# EAGLE design lilla.pa1 (EAGLE 4.11)
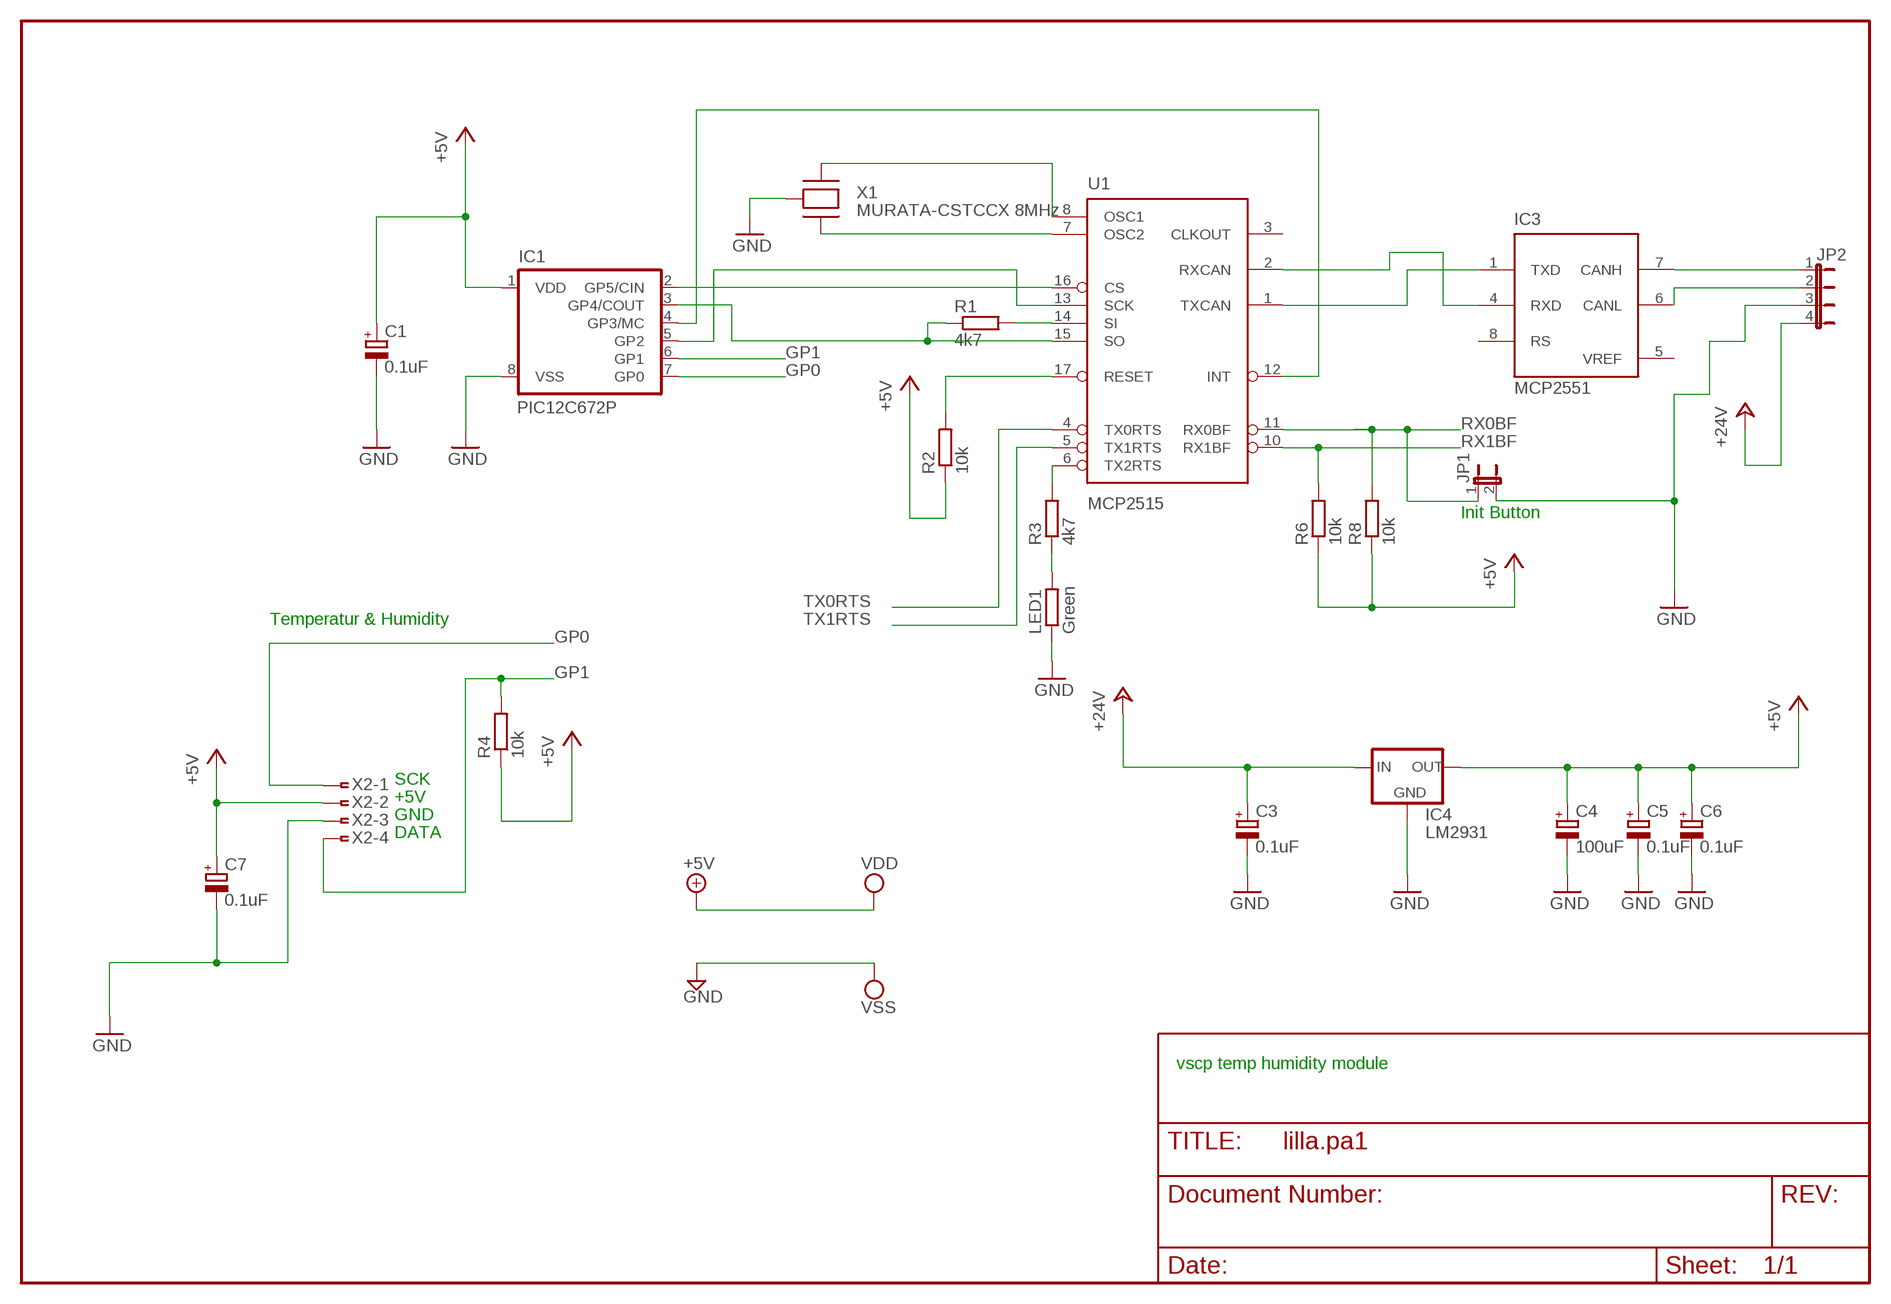
[diagram p0: schematic, sheet 1]

## Parts
C1  0.1uF  CPOL-EUCT3216  [CT3216]
C3  0.1uF  CPOL-EUCT3216  [CT3216]
C4  100uF  CPOL-EUCT7343  [CT7343]
C5  0.1uF  CPOL-EUCT3216  [CT3216]
C6  0.1uF  CPOL-EUCT3216  [CT3216]
C7  0.1uF  CPOL-EUCT3216  [CT3216]
IC1  PIC12C672P  [DIL8]
IC3  MCP2551  MCP2551SN  [SO-08]
IC4  LM2931  78LXX  [78LXX]
JP1  JP1E  [JP1]
JP2  JP4E  [JP4]
LED1  Green  R-EU_R1206  [R1206]
R1  4k7  R-EU_R0805  [R0805]
R2  10k  R-EU_R0805  [R0805]
R3  4k7  R-EU_R0805  [R0805]
R4  10k  R-EU_R0805  [R0805]
R6  10k  R-EU_R0805  [R0805]
R8  10k  R-EU_R0805  [R0805]
U1  MCP2515  MCP2510SO  [SO-18W]
X1  MURATA-CSTCCX 8MHz  MURATA-CSTCCX  [RESONATOR-MURATA-CSTCCX]
X2  FTOP-4  [FTOP-4]

## Nets
+5V: C1.+ C4.+ C5.+ C6.+ C7.+ IC1.1(VDD) IC4.OUT R2.1 R4.1 R6.1 R8.1 X2.2
+24V: C3.+ IC4.IN JP2.4
CANH: IC3.7(CANH) JP2.1
CANL: IC3.6(CANL) JP2.2
GND: C1.- C3.- C4.- C5.- C6.- C7.- IC1.8(VSS) IC4.GND JP1.2 JP2.3 LED1.1 X1.2(GND) X2.3
GP0: IC1.7(GP0) X2.1
GP1: IC1.6(GP1) R4.2 X2.4
GP2: IC1.5(GP2) U1.13(SCK)
GP3: IC1.4(GP3/MC) U1.12(INT)
GP4: IC1.3(GP4/COUT) R1.1 U1.15(SO)
GP5: IC1.2(GP5/CIN) U1.16(CS)
N$3: R2.2 U1.17(RESET)
N$7: R1.2 U1.14(SI)
N$10: LED1.2 R3.1
OSC1: U1.8(OSC1) X1.3(XTIN)
OSC2: U1.7(OSC2) X1.1(XTOUT)
RX0BF: JP1.1 R8.2 U1.11(RX0BF)
RX1BF: R6.2 U1.10(RX1BF)
RXCAN: IC3.4(RXD) U1.2(RXCAN)
TX0RTS: U1.4(TX0RTS)
TX1RTS: U1.5(TX1RTS)
TX2RTS: R3.2 U1.6(TX2RTS)
TXCAN: IC3.1(TXD) U1.1(TXCAN)
Unconnected: IC3.8(RS) U1.3(CLKOUT)

## Notes on the sheet
- Init Button
- Temperatur & Humidity
- SCK
- +5V
- GND
- DATA
- vscp temp humidity module

## Power pins joined to a net without a drawn wire
VDD: IC3.3(VDD) U1.18(VDD)
VREF: IC3.5(VREF)
VSS: IC3.2(VSS) U1.9(VSS)

## Library data of the parts
C1 C3-C7 = rcl:CPOL-EU: POLARIZED CAPACITOR, European symbol
IC1 = microchip:PIC12C*?: MICROCONTROLLER
IC3 = microchip_can:MCP2551: High Speed CAN tranceiver
IC4 = v-reg:78LXX: VOLTAGE REGULATOR
JP1 = jumper:JP1E: JUMPER
JP2 = jumper:JP4E: JUMPER
LED1 R1-R4 R6 R8 = rcl:R-EU_: RESISTOR, European symbol
U1 = microchip_can:MCP2510
X1 = eurosource_ftdi:MURATA-CSTCCX
X2 = con-amp:FTOP-4: AMP connector

## Board
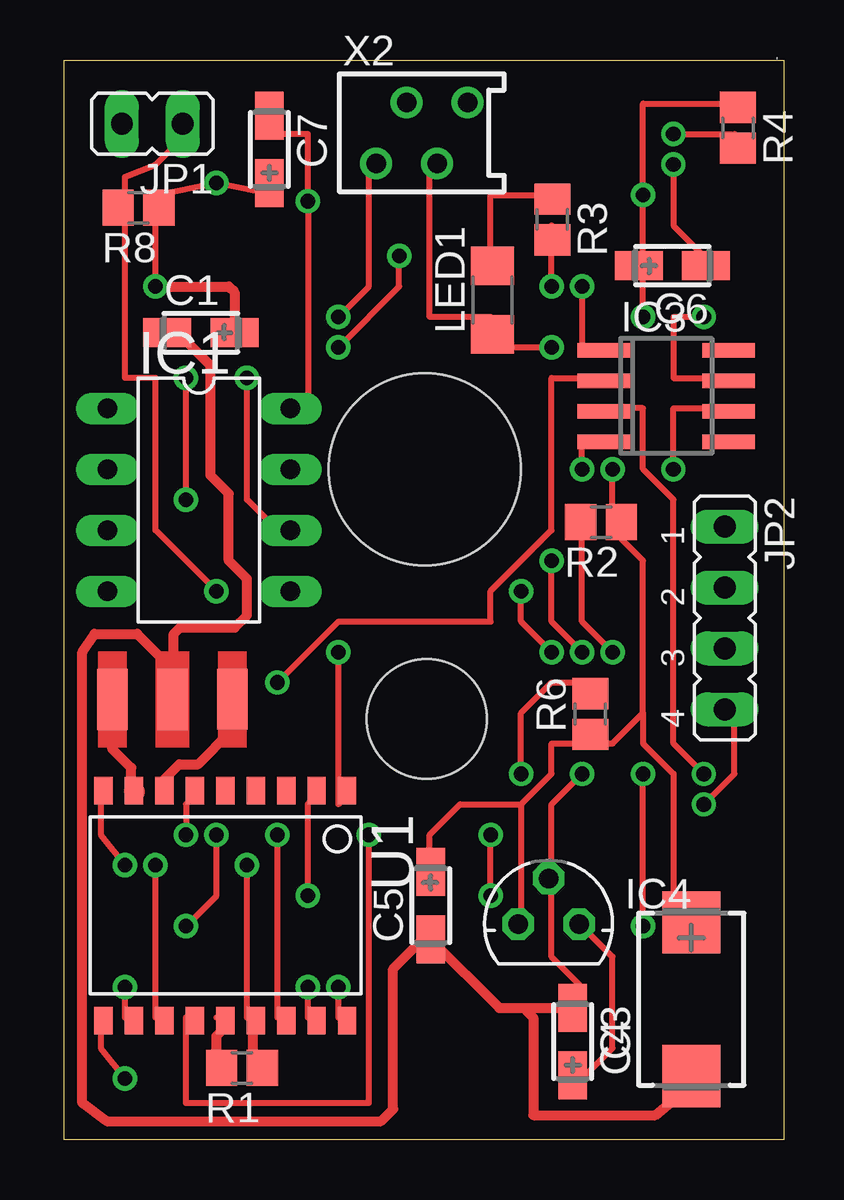
[diagram p1: board, top side]
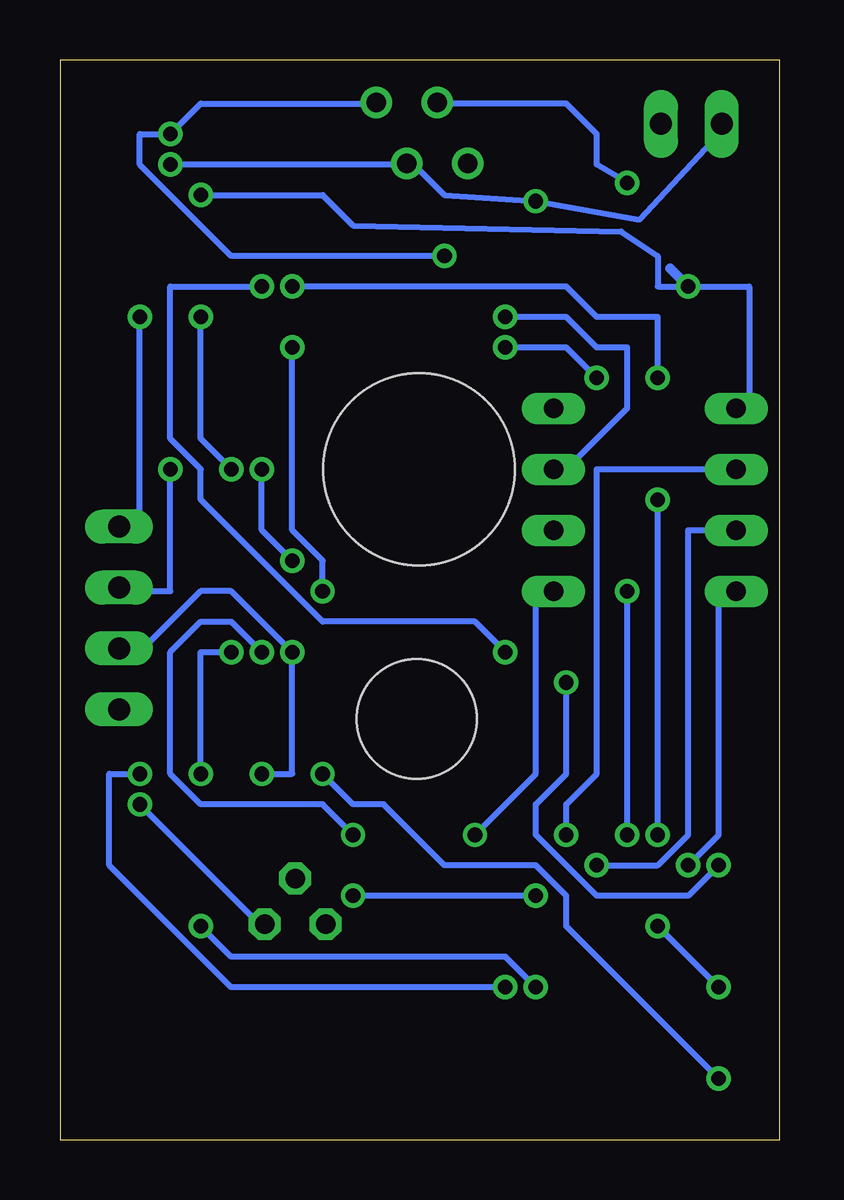
[diagram p2: board, bottom side, seen from below]

Size 30 x 45 mm. Coordinates in mm from the lower left corner, seen from the top.
Copper layers (1*16): Top 0.0254mm / dielectric 1.4986mm / Bottom 0.0254mm
Design rules "default": minimum track width 10mil, minimum drill 24mil, track to track 8mil, track to pad 8mil, pad to pad 8mil, via to via 8mil, smd to smd 0mil, copper to edge 40mil, drill to drill 8mil, minimum pad ring 10mil, minimum via ring 8mil, stop-mask expansion 4mil, vias tented up to drill 0mil, thermal gap 10mil

### Footprints (pad centres in the part's own frame; a part is rotated, then mirrored left to right if it is on the bottom)
CT3216 = smd 2 x 1.2: + 1.4,0; - -1.4,0
CT7343 = smd 2.6 x 2.4: + 3.2,0; - -3.2,0
DIL8 = drill 0.813 long: 1 -3.81,-3.81; 2 -1.27,-3.81; 3 1.27,-3.81; 4 3.81,-3.81; 5 3.81,3.81; 6 1.27,3.81; 7 -1.27,3.81; 8 -3.81,3.81
SO-08 = smd 0.6 x 2.2: 1 -1.905,-2.6; 2 -0.635,-2.6; 3 0.635,-2.6; 4 1.905,-2.6; 5 1.905,2.6; 6 0.635,2.6; 7 -0.635,2.6; 8 -1.905,2.6
78LXX = drill 0.813 octagon: GND 0,1.905; IN 1.27,0; OUT -1.27,0
JP1 = drill 0.914 long: 1 0,-1.27; 2 0,1.27
JP4 = drill 0.914 long: 1 -3.81,0; 2 -1.27,0; 3 1.27,0; 4 3.81,0
R1206 = smd 1.6 x 1.803: 1 -1.422,0; 2 1.422,0
R0805 = smd 1.3 x 1.5: 1 -0.85,0; 2 0.85,0
SO-18W = smd 0.762 x 1.143: 1 -5.08,-4.788; 2 -3.81,-4.788; 3 -2.54,-4.788; 4 -1.27,-4.788; 5 0,-4.788; 6 1.27,-4.788; 7 2.54,-4.788; 8 3.81,-4.788; 9 5.08,-4.788; 10 5.08,4.788; 11 3.81,4.788; 12 2.54,4.788; 13 1.27,4.788; 14 0,4.788; 15 -1.27,4.788; 16 -2.54,4.788; 17 -3.81,4.788; 18 -5.08,4.788
SMALL_VSCP = hole 5: 15.124,17.532 | hole 8: 15.032,27.937
RESONATOR-MURATA-CSTCCX = smd 2.54 x 1.27: 1 -0.005,2.405; 2 0,-0.1; 3 0,-2.6
FTOP-4 = drill 0.813 round: 1 -1.905,-1.27; 2 -0.635,1.27; 3 0.635,-1.27; 4 1.905,1.27

### Placement (x,y rotation side)
C1  5.7,33.63 0 top
C3  21.2,4.08 270 top
C4  26.15,5.85 90 top
C5  15.28,9.75 90 top
C6  25.36,36.42 180 top
C7  8.55,41.27 270 top
IC1  5.62,26.66 270 top
IC3  25.1,31 270 top
IC4  20.2,8.98 0 top
JP1  3.68,42.34 90 top
JP2  27.54,21.74 270 top
LED1  17.86,34.99 90 top
R1  7.41,2.98 180 top
R2  22.38,25.73 180 top
R3  20.36,38.35 270 top
R4  28.09,42.17 270 top
R6  21.94,17.74 90 top
R8  3.1,38.84 180 top
U1  6.72,9.75 180 top
U$2  [SMALL_VSCP]  0,0 0 top
X1  4.61,18.35 270 top
X2  14.91,41.96 0 top

### Tracks (layer width: path | path; a pad name or v marks a point on that pad's centre or on a via)
+5V  (via drill 0.61)
  Top 0.254: 21.59,16.51 20.32,16.51 20.32,15.24 19.05,13.97 | 19.05,13.97 19.05,8.89 IC4.OUT | 22.86,25.4 24.13,24.13 24.13,17.78 | 24.13,17.78 22.86,16.51 21.59,16.51 | 21.59,16.51 R6.1 | 19.05,13.97 16.51,13.97 15.24,12.7 15.24,11.43 C5.+ | 24.13,17.78 24.13,16.51 25.4,15.24 25.4,10.16 C4.+ | 24.13,36.83 v24.13,39.37 24.13,43.18 27.94,43.18 R4.1 | 3.81,39.37 v6.35,39.88 8.89,39.37 C7.+ | v3.81,35.56 3.81,39.37 | 3.81,39.37 R8.1 | 22.86,25.4 v22.86,27.94 | v24.13,34.29 24.13,36.83 | 22.86,25.4 R2.1 | 24.13,36.83 C6.+
  Top 0.406: C1.+ 7.1,35.32 6.86,35.56 v3.81,35.56
  Bottom 0.254: IC1.1 1.27,30.48 1.27,35.56 v3.81,35.56 5.08,35.56 5.08,36.83 6.6,37.85 17.78,38.1 19.05,39.37 v24.13,39.37 | v6.35,39.88 7.62,40.64 7.62,41.91 8.89,43.18 13.97,43.18 X2.2 | v22.86,27.94 24.13,29.21 v24.13,34.29
  Bottom 0.406: v3.81,35.56 4.57,36.32
+24V  (via drill 0.61)
  Top 0.254: C3.+ 21.59,2.54 22.86,3.81 22.86,7.62 21.59,8.89 IC4.IN | v26.67,13.97 27.94,15.24 27.94,17.78 JP2.4
  Bottom 0.254: v26.67,13.97 21.59,8.89 IC4.IN
CANH  (via drill 0.61)
  Top 0.254: v26.67,34.29 25.4,34.29 25.4,31.75 26.67,31.75 IC3.7
  Bottom 0.254: v26.67,34.29 26.67,25.4 JP2.1
CANL  (via drill 0.61)
  Top 0.254: v25.4,27.94 25.4,30.48 26.67,30.48 IC3.6
  Bottom 0.254: v25.4,27.94 25.4,22.86 26.67,22.86 JP2.2
GND  (via drill 0.61)
  Top 0: 9.6,30.59 9.48,30.47 IC1.8
  Top 0.254: 20.32,11.43 20.32,7.62 21.59,6.35 C3.- | v25.4,40.64 25.4,38.1 26.67,36.83 C6.- | v21.59,15.24 20.32,13.97 20.32,11.43 | 20.32,11.43 IC4.GND | 10.16,30.48 v10.16,39.12 10.16,41.91 8.89,41.91 C7.- | X2.3 15.24,40.64 15.24,34.29 17.78,34.29 LED1.1 17.78,33.02 v20.32,33.02 | v20.32,20.32 19.05,21.59 v19.05,22.86
  Top 0.406: C5.- 15.24,8.38 | C5.- 15.28,8.6 15.24,8.64 13.72,7.11 13.72,1.27 13.21,0.76 1.78,0.76 0.76,1.52 0.76,20.32 1.27,21.08 3.05,21.08 4.51,19.62 X1.2 4.51,18.48 4.57,18.54 4.57,21.08 4.83,21.34 7.11,21.34 7.62,21.84 7.62,23.37 6.86,24.13 6.86,26.92 6.1,27.69 6.1,32.26 4.72,33.63 C1.- | 19.3,5.48 18.14,5.48 C5.- | 19.3,5.48 C3.- | C4.- 26.15,2.27 24.64,1.02 19.56,1.02 19.56,5.08 19.3,5.33 19.3,5.48
  Top 0.813: 10.16,30.48 IC1.8
  Bottom 0.254: 15.24,40.64 v25.4,40.64 | v21.59,15.24 20.32,15.24 v20.32,20.32 22.86,22.86 24.13,22.86 26.67,20.32 JP2.3 | 15.24,40.64 13.97,39.37 v10.16,39.12 5.84,38.35 2.54,41.91 JP1.2 | X2.3 15.24,40.64 | v19.05,22.86 19.05,24.13 20.32,25.4 v20.32,33.02
GP0  (via drill 0.61)
  Top 0.254: v11.43,34.29 12.7,35.56 12.7,40.64 X2.1
  Bottom 0.254: v11.43,34.29 8.89,34.29 7.62,33.02 6.35,33.02 6.35,30.48 8.89,27.94 IC1.7
GP1  (via drill 0.61)
  Top 0.254: v25.4,41.91 27.94,41.91 R4.2 | v7.62,31.75 7.62,26.67 8.89,25.4 IC1.6 | v11.43,33.02 13.97,35.56 v13.97,36.83
  Bottom 0.254: X2.4 16.51,43.18 24.13,43.18 v25.4,41.91 26.67,41.91 26.67,40.64 22.86,36.83 v13.97,36.83 | v7.62,31.75 8.89,33.02 v11.43,33.02
GP2  (via drill 0.61)
  Top 0.254: v12.7,12.7 12.7,1.52 5.08,1.52 5.08,5.08 U1.13
  Bottom 0.254: v12.7,12.7 10.16,15.24 10.16,22.86 IC1.5
GP3  (via drill 0.61)
  Top 0.254: v3.81,11.43 3.81,5.08 U1.12
  Bottom 0.254: v3.81,11.43 2.54,12.7 2.54,22.86 IC1.4
GP4  (via drill 0.61)
  Top 0.254: R1.1 7.87,2.54 | v7.62,11.43 7.62,5.08 U1.15
  Top 0.406: 8.01,4.96 8.13,5.08 | 8.01,4.96 U1.15 | 7.87,2.54 7.87,4.83 8.01,4.96
  Bottom 0.254: v7.62,11.43 5.08,11.43 3.81,12.7 3.81,25.4 2.54,25.4 IC1.3
GP5  (via drill 0.61)
  Top 0.254: v8.89,12.7 8.89,5.08 U1.16
  Bottom 0.254: v8.89,12.7 8.89,13.97 7.62,15.24 7.62,27.94 2.54,27.94 IC1.2
N$3  (via drill 0.61)
  Top 0.254: v10.16,6.35 10.16,5.08 U1.17 | v24.13,8.89 v24.13,15.24 | v22.86,20.32 21.59,21.59 21.59,25.4 R2.2
  Bottom 0.254: v10.16,6.35 11.43,7.62 22.86,7.62 v24.13,8.89 | v24.13,15.24 24.13,20.32 v22.86,20.32
N$7
  Top 0.254: U1.14 6.35,5.08 | R1.2 6.35,2.54
  Top 0.406: U1.14 6.86,4.83 6.35,4.32 6.35,2.54
N$10
  Top 0.254: R3.1 20.32,39.37 17.78,39.37 17.78,36.83 LED1.2
OSC1
  Top 0: U1.8
  Top 0.406: X1.3 2.01,16.28 2.79,15.49 2.79,14.48 2.85,14.54 U1.8
  Top 0.813: U1.8 2.95,14.48
OSC2
  Top 0.406: U1.7 4.18,15.02 4.8,15.64 5.58,15.64 6.96,17.02 6.96,18.27 7.01,18.31 X1.1
RX0BF  (via drill 0.61)
  Top 0.254: v2.54,6.35 2.54,5.08 U1.11 | v5.08,8.89 6.35,10.16 v6.35,12.7 | v6.35,22.86 3.81,25.4 3.81,31.75 2.54,31.75 2.54,39.37 | 2.54,39.37 2.54,40.13 3.81,40.64 5.08,41.91 JP1.1 | 2.54,39.37 R8.2
  Bottom 0.254: v2.54,6.35 v5.08,8.89 | v6.35,12.7 v6.35,22.86
RX1BF  (via drill 0.61)
  Top 0.254: v2.54,2.54 1.52,3.81 1.52,5.08 U1.10 | v19.05,15.24 19.05,17.78 20.32,19.05 21.59,19.05 R6.2
  Bottom 0.254: v2.54,2.54 8.89,8.89 8.89,10.16 10.16,11.43 13.97,11.43 16.51,13.97 17.78,13.97 v19.05,15.24
RXCAN  (via drill 0.61)
  Top 0.254: v10.16,10.16 10.16,13.97 U1.2 | v17.78,10.16 v17.78,12.7 | v21.59,20.32 20.32,21.59 v20.32,24.13 | v21.59,27.94 21.59,29.21 IC3.4
  Bottom 0.254: v10.16,10.16 v17.78,10.16 | v17.78,12.7 19.05,13.97 24.13,13.97 25.4,15.24 25.4,20.32 24.13,21.59 22.86,21.59 v21.59,20.32 | v20.32,24.13 21.59,25.4 v21.59,27.94
TX2RTS  (via drill 0.61)
  Top 0.254: v5.08,12.7 5.08,13.97 U1.6 | v5.08,26.67 v5.08,31.75 | v20.32,35.56 20.32,38.1 R3.2
  Bottom 0.254: v5.08,12.7 v5.08,26.67 | v5.08,31.75 5.08,34.29 7.62,34.29 8.89,35.56 v20.32,35.56
TXCAN  (via drill 0.61)
  Top 0.254: v11.43,20.32 11.43,13.97 U1.1 | v21.59,35.56 21.59,33.02 IC3.1
  Bottom 0.254: v11.43,20.32 12.7,21.59 19.05,21.59 24.13,26.67 24.13,27.94 25.4,29.21 25.4,35.56 v21.59,35.56
VDD  (via drill 0.61)
  Top 0.254: v11.43,6.35 11.43,5.08 U1.18 | v26.67,15.24 25.4,16.51 25.4,26.67 24.13,27.94 24.13,30.48 22.86,30.48 IC3.3
  Bottom 0.254: v11.43,6.35 22.86,6.35 27.94,11.43 27.94,15.24 v26.67,15.24
VSS  (via drill 0.61)
  Top 0.254: v2.54,11.43 1.52,12.7 1.52,13.97 U1.9 | v8.89,19.05 11.43,21.59 17.78,21.59 17.78,22.86 20.32,25.4 20.32,31.75 21.59,31.75 IC3.2
  Bottom 0.254: v2.54,11.43 3.81,10.16 7.62,10.16 10.16,12.7 10.16,13.97 8.89,15.24 v8.89,19.05